# Altium schematic sheet SR4K_PHY6222_v1.SchDoc
size A4
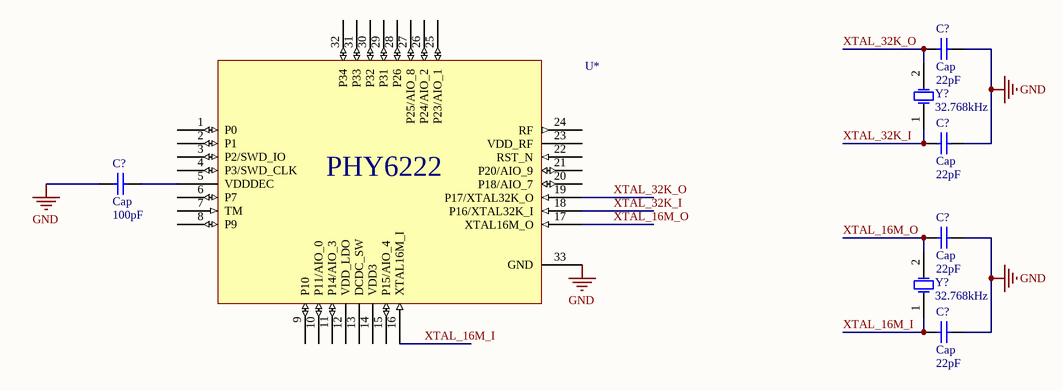
[diagram p0: SR4K_PHY6222_v1.SchDoc]

## Parts
(Parts that share a designator on the sheet are numbered #1, #2 ... from top to bottom, then left to right.)
C?#1  Cap  value 22pF  [RAD-0.3]
C?#2  Cap  value 22pF  [RAD-0.3]
C?#3  Cap  value 100pF  [RAD-0.3]
C?#4  Cap  value 22pF  [RAD-0.3]
C?#5  Cap  value 22pF  [RAD-0.3]
U*  U*  (value not drawn)
Y?#1  32.768kHz  [R38]
Y?#2  32.768kHz  [R38]

## Nets
GND: C?#1.1 C?#2.1 C?#3.1 C?#4.1 C?#5.1 U*.33(GND)
XTAL_16M_I: C?#5.2 U*.16(XTAL16M_I) Y?#2.1(OSC1)
XTAL_16M_O: C?#4.2 U*.17(XTAL16M_O) Y?#2.2(OSC2)
XTAL_32K_I: C?#2.2 U*.18(P16/XTAL32K_I) Y?#1.1(OSC1)
XTAL_32K_O: C?#1.2 U*.19(P17/XTAL32K_O) Y?#1.2(OSC2)
NetC?#3_2: C?#3.2 U*.5(VDDDEC)

Not connected (* = marked no-connect by the designer): U* 1(P0) 2(P1) 3(P2/SWD_IO) 4(P3/SWD_CLK) 6(P7) 7(TM) 8(P9) 9(P10) 10(P11/AIO_0) 11(P14/AIO_3) 12(VDD_LDO) 13(DCDC_SW) 14(VDD3) 15(P15/AIO_4) 20(P18/AIO_7) 21(P20/AIO_9) 22(RST_N) 23(VDD_RF) 24(RF) 25(P23/AIO_1) 26(P24/AIO_2) 27(P25/AIO_8) 28(P26) 29(P31) 30(P32) 31(P33) 32(P34)

## Library data of the parts
C?#1-C?#5 = Cap: Capacitor; Published: 8-Jun-2000; LatestRevisionDate: 17-Jul-2002; LatestRevisionNote: Re-released for DXP Platform.; PackageReference: RAD-0.3; Publisher: Altium Limited; PackageDescription: Radial Cap, Thru-Hole; 2 Leads; 0.3 in Pin Spacing
U* = PHY6222
Y?#1 Y?#2 = XTAL: Crystal Oscillator; Published: 8-Jun-2000; LatestRevisionDate: 17-Jul-2002; LatestRevisionNote: Re-released for DXP Platform.; PackageReference: R38; Publisher: Altium Limited; PackageDescription: Crystal, Thru-Hole; 2 Leads; Body 3.1 x 8.2 mm (Dia.xH)